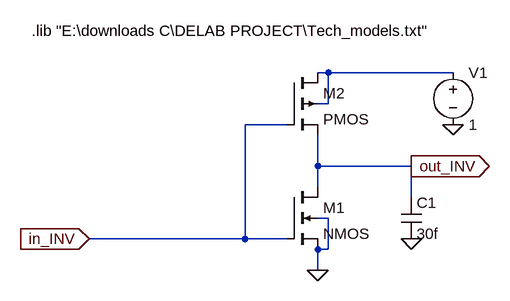
[diagram p0: schematic gate_invv.asc]
gate_invv.asc, the LTspice schematic file:
Version 4
SHEET 1 880 680
WIRE 240 32 224 32
WIRE 432 32 240 32
WIRE 240 80 240 32
WIRE 240 80 224 80
WIRE 176 112 112 112
WIRE 224 176 224 128
WIRE 368 176 224 176
WIRE 224 208 224 176
WIRE 368 224 368 176
WIRE 240 256 224 256
WIRE 112 288 112 112
WIRE 112 288 -128 288
WIRE 176 288 112 288
WIRE 240 304 240 256
WIRE 240 304 224 304
WIRE 224 336 224 304
FLAG 224 336 0
FLAG 432 112 0
FLAG -128 288 in_INV
IOPIN -128 288 In
FLAG 368 176 out_INV
IOPIN 368 176 Out
FLAG 368 288 0
SYMBOL nmos4 176 208 R0
SYMATTR InstName M1
SYMATTR Value2 l=32n w=64n
SYMBOL pmos4 176 32 R0
SYMATTR InstName M2
SYMATTR Value2 l=32n w=128n
SYMBOL voltage 432 16 R0
WINDOW 123 0 0 Left 0
WINDOW 39 0 0 Left 0
SYMATTR InstName V1
SYMATTR Value 1
SYMBOL cap 352 224 R0
SYMATTR InstName C1
SYMATTR Value 30f
TEXT -216 -32 Left 2 !.lib "E:\\downloads C\\DELAB PROJECT\\Tech_models.txt"

The netlist it stands for:
* gate_invv.asc
M1 out_INV in_INV 0 0 NMOS l=32n w=64n
M2 N001 in_INV out_INV N001 PMOS l=32n w=128n
V1 N001 0 1
C1 out_INV 0 30f
.model NMOS NMOS
.model PMOS PMOS
.lib standard.mos
.lib "E:\downloads C\DELAB PROJECT\Tech_models.txt"
.backanno
.end